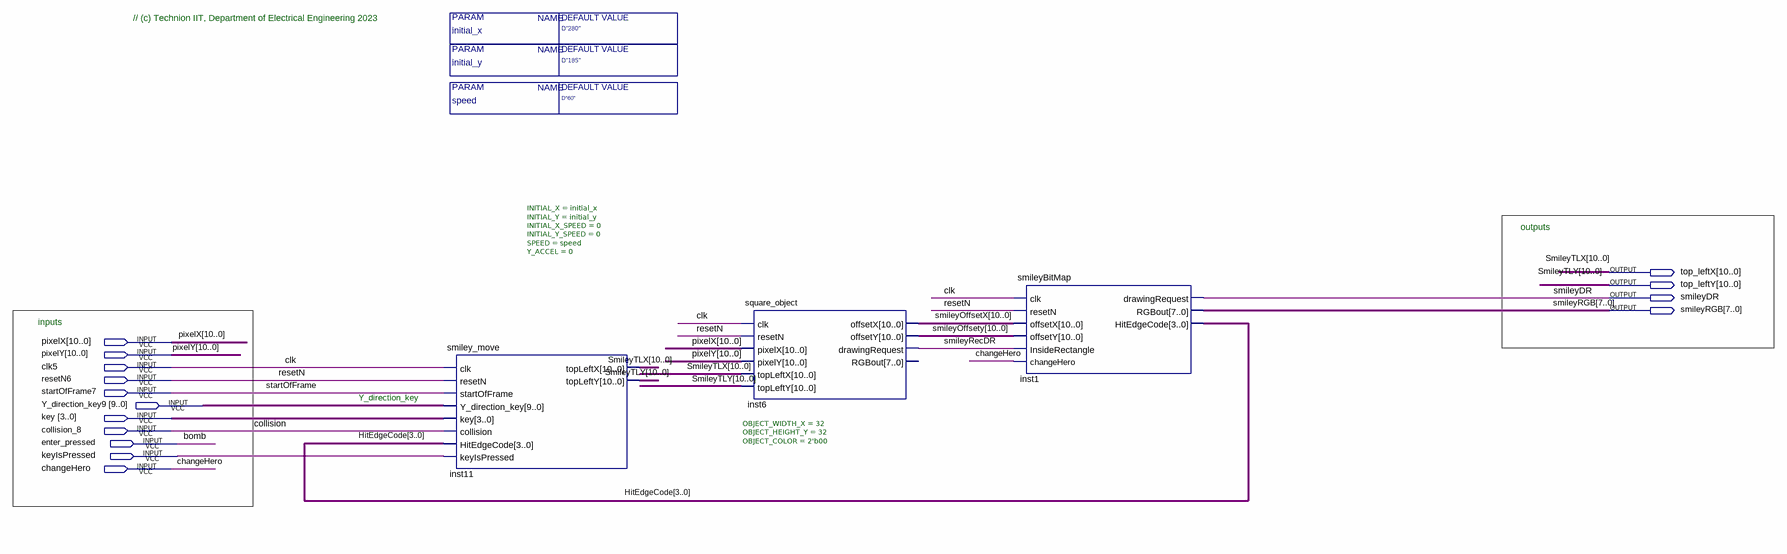
[diagram p0: schematic sheet]
// Quartus schematic Smiley_Block_T.bdf as structural Verilog: 3 symbols, 15 pins
module Smiley_Block_T #(parameter initial_x = "D\"280\"", parameter initial_y = "D\"185\"", parameter speed = "D\"60\"") (
  input  [10:0] pixelX,
  input  [10:0] pixelY,
  input  clk5,
  input  resetN6,
  input  startOfFrame7,
  input  [9:0] Y_direction_key9,
  input  [3:0] key,
  input  collision_8,
  input  enter_pressed,
  input  keyIsPressed,
  input  changeHero,
  output [10:0] top_leftX,
  output [10:0] top_leftY,
  output smileyDR,
  output [7:0] smileyRGB
);

  wire smileyRecDR;
  wire [3:0] HitEdgeCode;
  wire [10:0] smileyOffsetX, smileyOffsety;

  smiley_move #(.INITIAL_X(initial_x), .INITIAL_Y(initial_y), .INITIAL_X_SPEED(0), .INITIAL_Y_SPEED(0), .SPEED(speed), .Y_ACCEL(0)) inst11 (
    .clk(clk5), .resetN(resetN6), .startOfFrame(startOfFrame7), .Y_direction_key(Y_direction_key9),
    .key(key), .collision(collision_8), .HitEdgeCode(HitEdgeCode), .keyIsPressed(keyIsPressed),
    .topLeftX(top_leftX), .topLeftY(top_leftY));
  square_object #(.OBJECT_WIDTH_X(32), .OBJECT_HEIGHT_Y(32), .OBJECT_COLOR(2'b00)) inst6 (
    .clk(clk5), .resetN(resetN6), .pixelX(pixelX), .pixelY(pixelY), .topLeftX(top_leftX),
    .topLeftY(top_leftY), .offsetX(smileyOffsetX), .offsetY(smileyOffsety), .drawingRequest(smileyRecDR));  // open: RGBout
  smileyBitMap inst1 (
    .clk(clk5), .resetN(resetN6), .offsetX(smileyOffsetX), .offsetY(smileyOffsety),
    .InsideRectangle(smileyRecDR), .changeHero(changeHero), .drawingRequest(smileyDR), .RGBout(smileyRGB),
    .HitEdgeCode(HitEdgeCode));

  // Other names for the same wires on the sheet: bomb = enter_pressed; clk = clk5; collision = collision_8;
  //   resetN = resetN6; SmileyTLX[10:0] = top_leftX; SmileyTLY[10:0] = top_leftY; startOfFrame = startOfFrame7

  // Notes on the sheet:
  //   // (c) Technion IIT, Department of Electrical Engineering 2023
  //   outputs
  //   inputs
  //   Y_direction_key
endmodule
